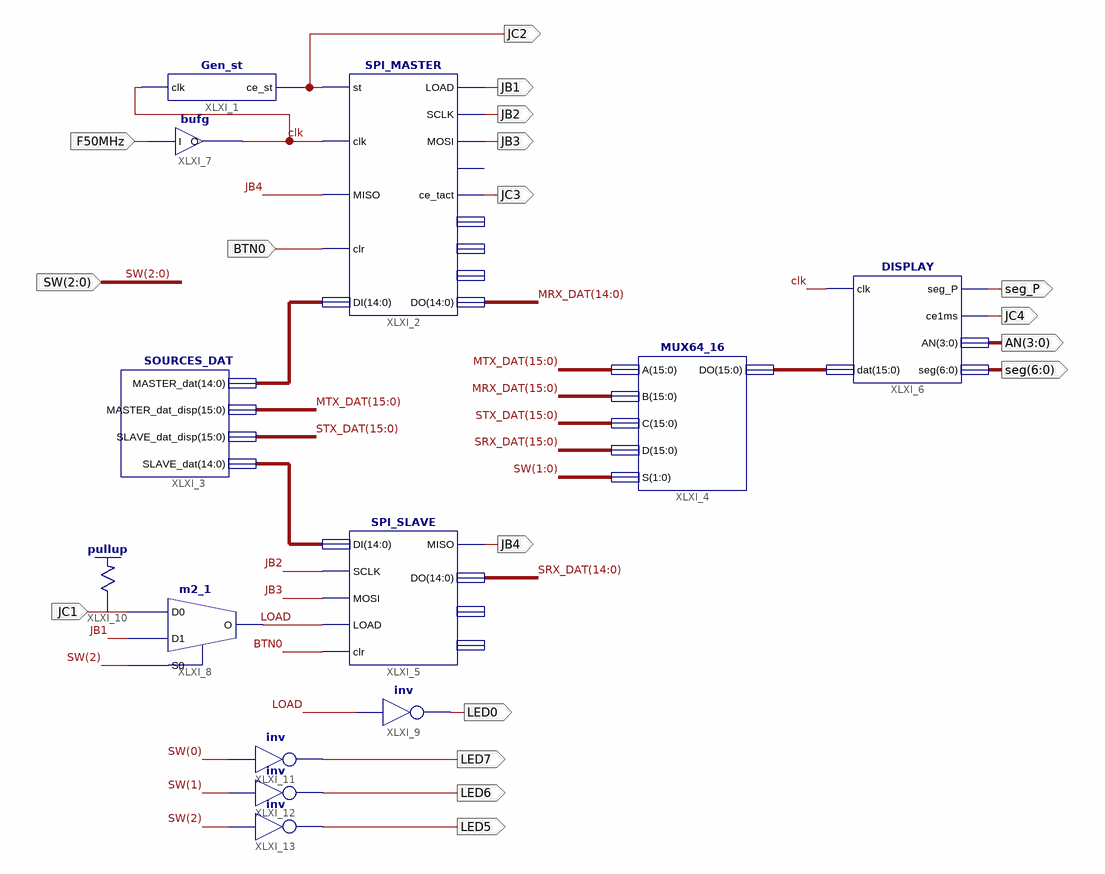
[diagram p0: schematic sheet 1]
// Xilinx ISE schematic Sch_Lab407ND.sch (spartan3e) as structural Verilog: 13 symbols, 18 ports
module Sch_Lab407ND (
  input  F50MHz,
  input  BTN0,
  input  JC1,
  input  [2:0] SW,
  output JC2,
  output JB1,
  output JB2,
  output JB3,
  output JC3,
  output LED0,
  output JB4,
  output seg_P,
  output JC4,
  output [3:0] AN,
  output [6:0] seg,
  output LED7,
  output LED6,
  output LED5
);

  wire clk, LOAD;
  wire [14:0] XLXN_12, XLXN_13;
  wire [15:0] MRX_DAT, MTX_DAT, SRX_DAT, STX_DAT, XLXN_35;

  Gen_st XLXI_1 (.clk(clk), .ce_st(JC2));
  SPI_MASTER XLXI_2 (
    .st(JC2), .clk(clk), .MISO(JB4), .clr(BTN0), .DI(XLXN_12), .LOAD(JB1), .SCLK(JB2), .MOSI(JB3),
    .ce_tact(JC3), .DO(MRX_DAT[14:0]));  // open: ce, cb_bit, sr_MTX, sr_MRX
  SOURCES_DAT XLXI_3 (.MASTER_dat(XLXN_12), .MASTER_dat_disp(MTX_DAT), .SLAVE_dat_disp(STX_DAT), .SLAVE_dat(XLXN_13));
  MUX64_16 XLXI_4 (.A(MTX_DAT), .B(MRX_DAT), .C(STX_DAT), .D(SRX_DAT), .S(SW[1:0]), .DO(XLXN_35));
  SPI_SLAVE XLXI_5 (
    .MISO(JB4), .DO(SRX_DAT[14:0]), .DI(XLXN_13), .MOSI(JB3), .LOAD(LOAD), .clr(BTN0), .SCLK(JB2));  // open: sr_STX, sr_SRX
  DISPLAY XLXI_6 (.clk(clk), .dat(XLXN_35), .seg_P(seg_P), .ce1ms(JC4), .AN(AN), .seg(seg));
  bufg XLXI_7 (.I(F50MHz), .O(clk));
  m2_1 XLXI_8 (.D0(JC1), .D1(JB1), .S0(SW[2]), .O(LOAD));
  not XLXI_9 (LED0, LOAD);
  \pullup  XLXI_10 (.O(JC1));
  not XLXI_11 (LED7, SW[0]);
  not XLXI_12 (LED6, SW[1]);
  not XLXI_13 (LED5, SW[2]);
endmodule
